# Altium schematic sheet MCU.SchDoc
size A4
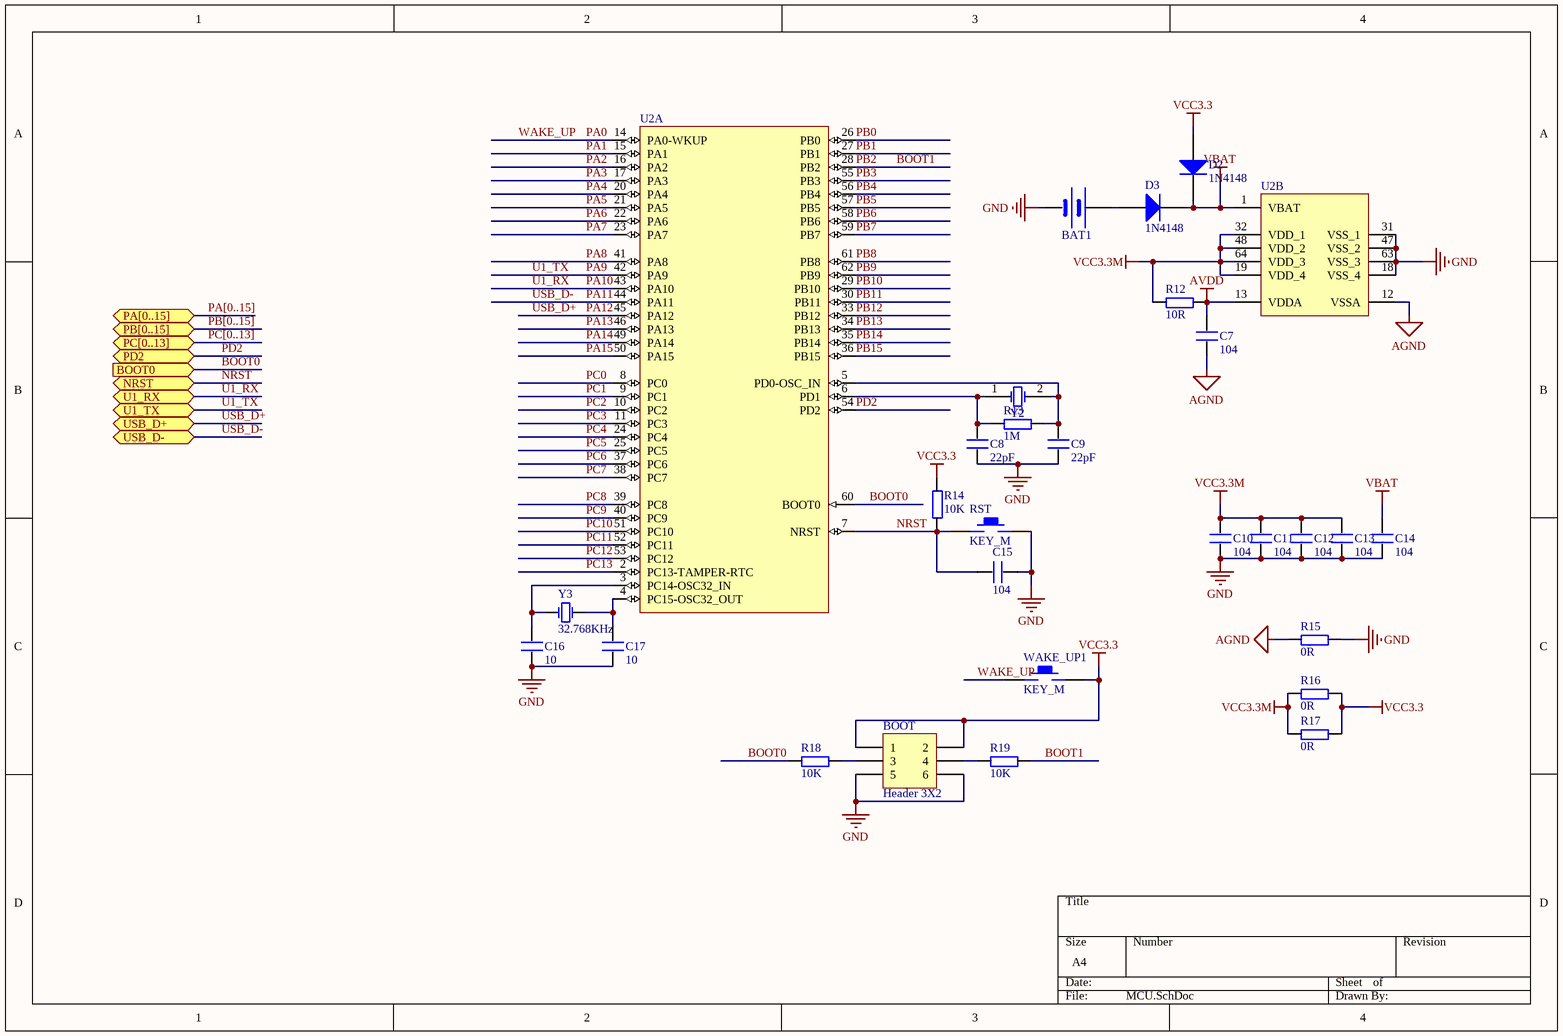
[diagram p0: MCU.SchDoc]

## Parts
BAT1  BATT  [CR1220_B]  (value not drawn)
BOOT  Header 3X2  [HDR2X3]
C7  104  [0603C]
C8  22pF  [0603C]
C9  22pF  [0603C]
C10  104  [0603C]
C11  104  [0603C]
C12  104  [0603C]
C13  104  [0603C]
C14  104  [0603C]
C15  104  [0603C]
C16  10  [0603C]
C17  10  [0603C]
D2  1N4148  [DIODE_SOP]
D3  1N4148  [DIODE_SOP]
R12  10R  [0603R]
R13  1M  [0603R]
R14  10K  [0603R]
R15  0R  [0603R]
R16  0R  [0603R]
R17  0R  [0603R]
R18  10K  [0603R]
R19  10K  [0603R]
RST  KEY_M  [KEY_SOP3625_B]
U2  (no value)  [LQFP64-10x10mm]  (parts A,B of 2)
WAKE_UP1  KEY_M  [KEY_SOP3625_B]
Y2  NX3225GD-8.000M-EXS00A-CG04874[N/A]  [XTAL_SMD]  (value not drawn)
Y3  32.768KHz  [XTAL_2SM_3R2X1R5]

## Ports
BOOT0 (in), NRST (bidir), PA[0..15], PB[0..15] (bidir), PC[0..13] (bidir), PD2 (bidir), U1_RX (bidir), U1_TX (bidir), USB_D+ (bidir), USB_D- (bidir)

## Nets
AGND: C7.1 R15.1 U2.12(VSSA)
AVDD: C7.2 R12.2 U2.13(VDDA)
GND: BAT1.2(GND) BOOT.5 BOOT.6 C8.1 C9.1 C10.1 C11.1 C12.1 C13.1 C14.1 C15.2 C16.1 C17.1 R15.2 RST.2 U2.18(VSS_4) U2.31(VSS_1) U2.47(VSS_2) U2.63(VSS_3)
VBAT: C14.2 D2.2(K) D3.2(K) U2.1(VBAT)
VCC3.3: BOOT.1 BOOT.2 D2.1(A) R14.2 R16.2 R17.2 WAKE_UP1.2
VCC3.3M: C10.2 C11.2 C12.2 C13.2 R12.1 R16.1 R17.1 U2.19(VDD_4) U2.32(VDD_1) U2.48(VDD_2) U2.64(VDD_3)
BOOT0: R18.1 U2.60(BOOT0) ; port BOOT0
BOOT1: R19.2 U2.28(PB2)  [also labelled PB2]
NRST: C15.1 R14.1 RST.1 U2.7(NRST) ; port NRST
PA0: U2.14(PA0-WKUP) WAKE_UP1.1  [also labelled WAKE_UP]
PA1: U2.15(PA1)
PA2: U2.16(PA2)
PA3: U2.17(PA3)
PA4: U2.20(PA4)
PA5: U2.21(PA5)
PA6: U2.22(PA6)
PA7: U2.23(PA7)
PA8: U2.41(PA8)
PA9: U2.42(PA9) ; port U1_TX  [also labelled U1_TX]
PA10: U2.43(PA10) ; port U1_RX  [also labelled U1_RX]
PA11: U2.44(PA11) ; port USB_D-  [also labelled USB_D-]
PA12: U2.45(PA12) ; port USB_D+  [also labelled USB_D+]
PA13: U2.46(PA13)
PA14: U2.49(PA14)
PA15: U2.50(PA15)
PB0: U2.26(PB0)
PB1: U2.27(PB1)
PB3: U2.55(PB3)
PB4: U2.56(PB4)
PB5: U2.57(PB5)
PB6: U2.58(PB6)
PB7: U2.59(PB7)
PB8: U2.61(PB8)
PB9: U2.62(PB9)
PB10: U2.29(PB10)
PB11: U2.30(PB11)
PB12: U2.33(PB12)
PB13: U2.34(PB13)
PB14: U2.35(PB14)
PB15: U2.36(PB15)
PC0: U2.8(PC0)
PC1: U2.9(PC1)
PC2: U2.10(PC2)
PC3: U2.11(PC3)
PC4: U2.24(PC4)
PC5: U2.25(PC5)
PC6: U2.37(PC6)
PC7: U2.38(PC7)
PC8: U2.39(PC8)
PC9: U2.40(PC9)
PC10: U2.51(PC10)
PC11: U2.52(PC11)
PC12: U2.53(PC12)
PC13: U2.2(PC13-TAMPER-RTC)
PD2: U2.54(PD2) ; port PD2
NetBAT1_1: BAT1.1(VCC) D3.1(A)
NetBOOT_3: BOOT.3 R18.2
NetBOOT_4: BOOT.4 R19.1
NetC8_2: C8.2 R13.1 U2.6(PD1) Y2.1(OSC1)
NetC9_2: C9.2 R13.2 U2.5(PD0-OSC_IN) Y2.2(OSC2)
NetC16_2: C16.2 U2.3(PC14-OSC32_IN) Y3.1(OSC1)
NetC17_2: C17.2 U2.4(PC15-OSC32_OUT) Y3.2(OSC2)

## Buses and harness runs
bus PA[0..15] = port PA[0..15]
bus PB[0..15] = port PB[0..15]
bus PC[0..13] = port PC[0..13]

## Library data of the parts
BAT1 = BAT
BOOT = Header 3X2: Header, 3-Pin, Dual row; LatestRevisionDate: 17-Jul-2002; LatestRevisionNote: Re-released for DXP Platform.; Publisher: Altium Limited
C7-C17 = C
D2 D3 = Diode: Default Diode; Code - JEDEC: DO-214-AB; Ordered by: STM; ECCN_US/EU: EAR99/NEC; Published: 8-Jun-2000; Revision: July-2002: Re-released for DXP Platform.; Publisher: Altium Limited
R12-R19 = R
U2 = STM32F103RCT6: STM32 ARM-based 32-bit MCU Performance Line with 256 kB Flash, 48 kB Internal RAM, -40 to +85癈 Temperature, 64-Pin LQFP, Tray; DatasheetVersion: rev8.0, Apr-2011; PackageVersion: rev13, Apr-2011; PackageReference: LQFP64; PackageDescription: 64-Pin Low-Profile Quad Flat Pack, 10 x 10 mm Body, 0.5 mm Pitch (LQFP64); ComponentLink1Description: Manufacturer URL; ComponentLink1URL: http://www.st.com/; ComponentLink2Description: STM32F103 Datasheet; ComponentLink2URL: http://www.st.com/internet/com/TECHNICAL_RESOURCES/TECHNICAL_LITERATURE/DATASHEET/CD00191185.pdf; ComponentLink3Description: STM32 Family Web Page; ComponentLink3URL: www.st.com/stm32
Y2 = XTAL: Crystal Oscillator; Published: 8-Jun-2000; LatestRevisionDate: 17-Jul-2002; LatestRevisionNote: Re-released for DXP Platform.; PackageReference: R38; Publisher: Altium Limited
Y3 = XTAL: 普通晶振; Published: 8-Jun-2000; LatestRevisionDate: 17-Jul-2002; LatestRevisionNote: Re-released for DXP Platform.; Publisher: Altium Limited